# EAGLE design HCPL-7xx (EAGLE 5.11)
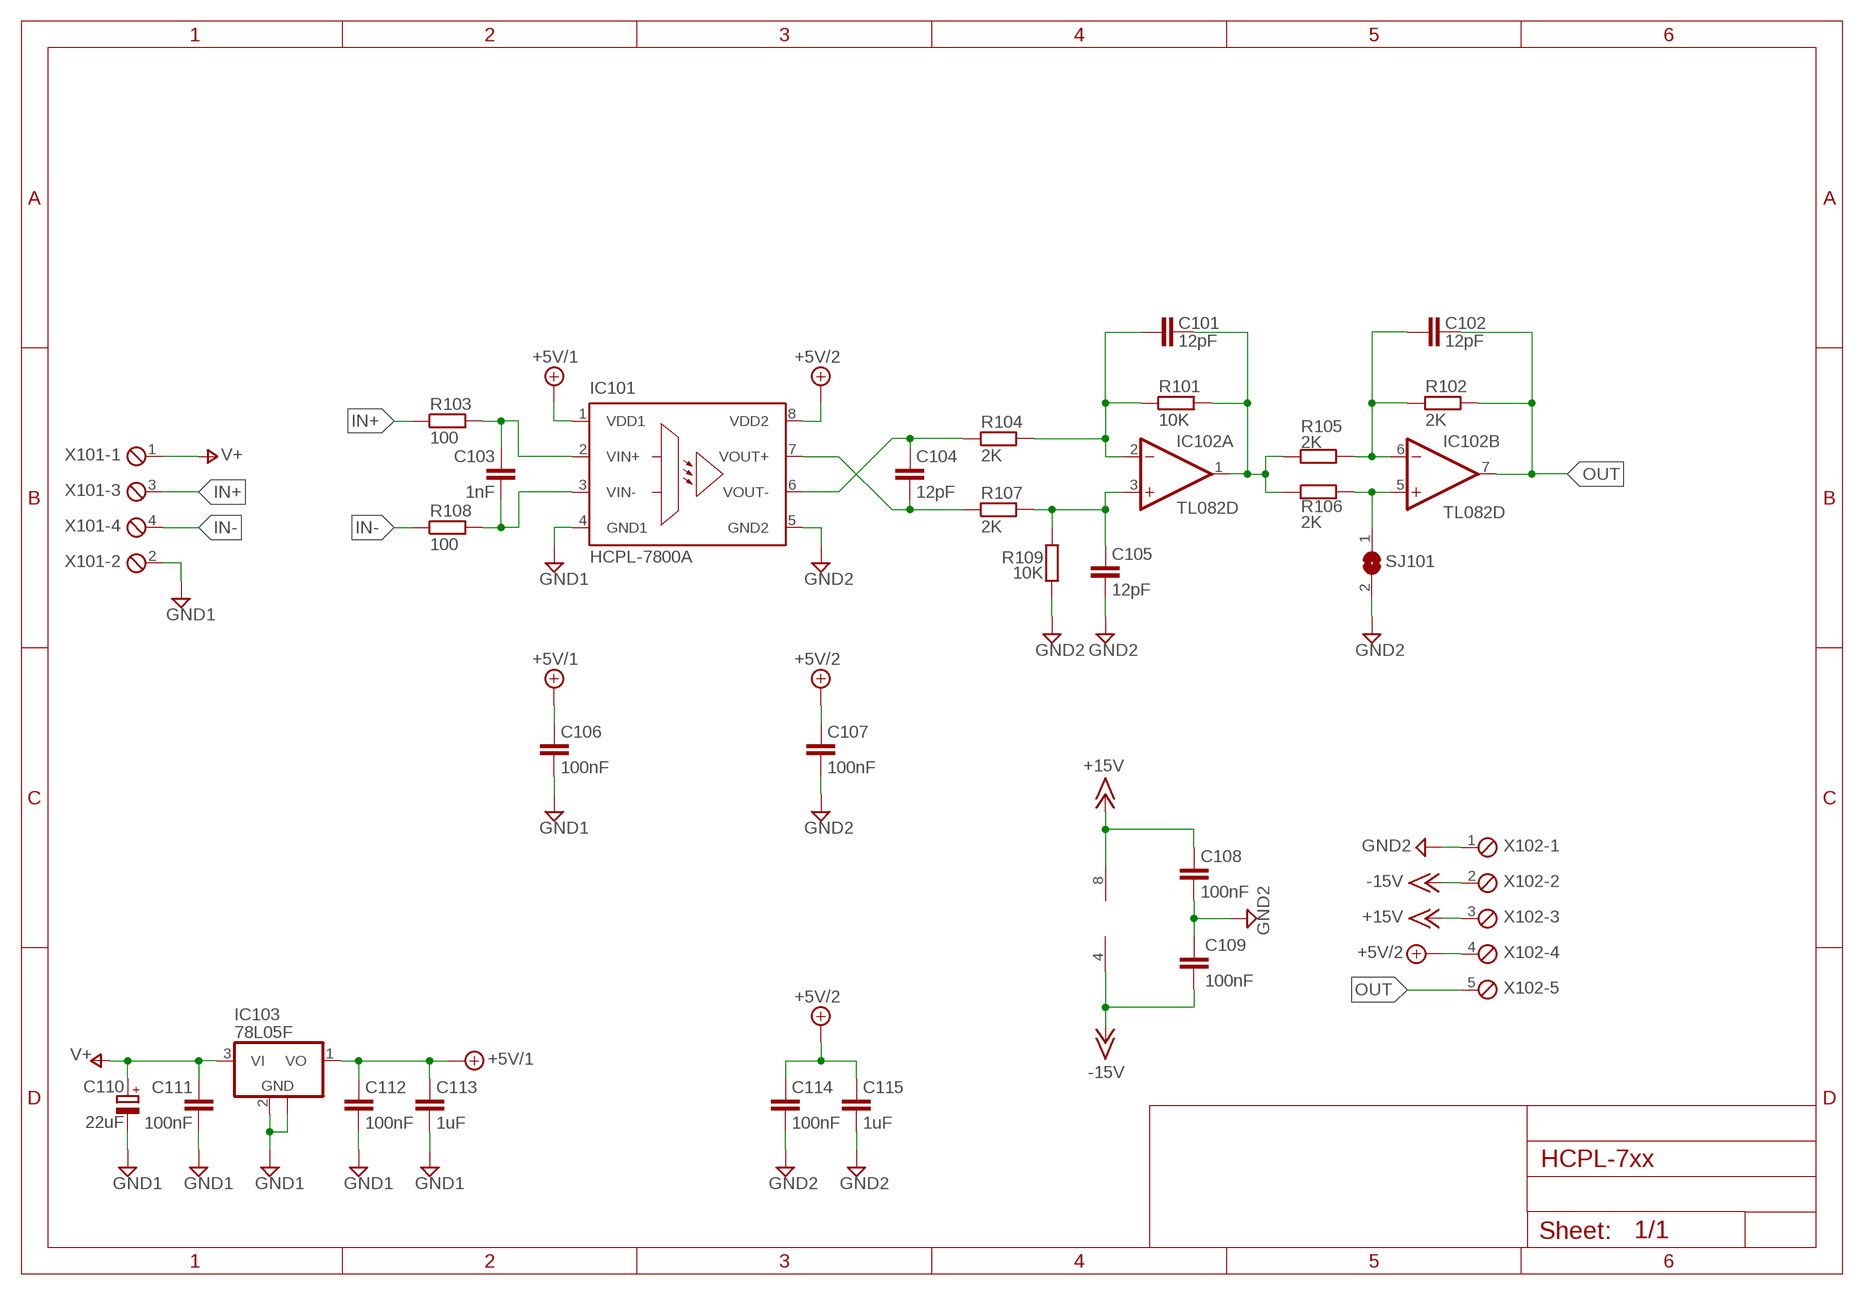
[diagram p0: schematic, sheet 1]

## Parts
C101  12pF  C-EUC0603  [C0603]
C102  12pF  C-EUC0603  [C0603]
C103  1nF  C-EUC0603  [C0603]
C104  12pF  C-EUC0603  [C0603]
C105  12pF  C-EUC0603  [C0603]
C106  100nF  C-EUC0603  [C0603]
C107  100nF  C-EUC0603  [C0603]
C108  100nF  C-EUC0603  [C0603]
C109  100nF  C-EUC0603  [C0603]
C110  22uF  CPOL-EU153CLV-0505  [153CLV-0505]
C111  100nF  C-EUC0603  [C0603]
C112  100nF  C-EUC0603  [C0603]
C113  1uF  C-EUC0603  [C0603]
C114  100nF  C-EUC0603  [C0603]
C115  1uF  C-EUC0603  [C0603]
IC101  HCPL-7800A  [DIP8]
IC102  TL082D  [SO08]
IC103  78L05F  [SOT89]
R101  10K  R-EU_R0603  [R0603]
R102  2K  R-EU_R0603  [R0603]
R103  100  R-EU_R0603  [R0603]
R104  2K  R-EU_R0603  [R0603]
R105  2K  R-EU_R0603  [R0603]
R106  2K  R-EU_R0603  [R0603]
R107  2K  R-EU_R0603  [R0603]
R108  100  R-EU_R0603  [R0603]
R109  10K  R-EU_R0603  [R0603]
SJ101  SJ  [SJ]
X101  MPT4  [4POL254]
X102  MPT5  [5POL254]

## Nets
+5V/1: C106.1 C112.1 C113.1 IC101.1(VDD1) IC103.1(VO)
+5V/2: C107.1 C114.1 C115.1 IC101.8(VDD2) X102.4
+15V: C108.1 IC102.8(P:V+) X102.3
-15V: C109.2 IC102.4(P:V-) X102.2
GND1: C106.2 C110.- C111.2 C112.2 C113.2 IC101.4(GND1) IC103.2(GND) IC103.2@1(GND) X101.2
GND2: C105.1 C107.2 C108.2 C109.1 C114.2 C115.2 IC101.5(GND2) R109.1 SJ101.2 X102.1
IN+: R103.1 X101.3
IN-: R108.1 X101.4
N$1: C101.1 IC102.2(A:-IN) R101.1 R104.2
N$2: C101.2 IC102.1(A:OUT) R101.2 R105.1 R106.1
N$3: C105.2 IC102.3(A:+IN) R107.2 R109.2
N$4: C103.2 IC101.3(VIN-) R108.2
N$5: C103.1 IC101.2(VIN+) R103.2
N$10: C104.2 IC101.7(VOUT+) R107.1
N$11: C104.1 IC101.6(VOUT-) R104.1
N$14: C102.1 IC102.6(B:-IN) R102.1 R105.2
N$16: IC102.5(B:+IN) R106.2 SJ101.1
OUT: C102.2 IC102.7(B:OUT) R102.2 X102.5
V+: C110.+ C111.1 IC103.3(VI) X101.1

## Library data of the parts
C101-C109 C111-C115 = rcl:C-EU: CAPACITOR, European symbol
C110 = rcl:CPOL-EU: POLARIZED CAPACITOR, European symbol
IC101 = avago:HCPL-7800: Isolation Amplifer Source: http://www.avagotech.com/docs/AV02-0410EN; MF: AGILENT TECHNOLOGIES; MPN: HCPL-7800A-000E; OC_FARNELL: 8550026; OC_NEWARK: 88H7847
IC102 = linear:TL082: OP AMP
IC103 = linear:78L*: POSITOIV-VOLTAGE REGULATORS Output up to 100 mA Source: http://focus.ti.com/lit/ds/symlink/ua78l05.pdf
R101-R109 = rcl:R-EU_: RESISTOR, European symbol
SJ101 = jumper:SJ: SMD solder JUMPER
X101 = con-phoenix-254:MPT4: PHOENIX CONNECTOR; OC_FARNELL: unknown; OC_NEWARK: unknown
X102 = con-phoenix-254:MPT5: PHOENIX CONNECTOR; OC_FARNELL: unknown; OC_NEWARK: unknown

## Board
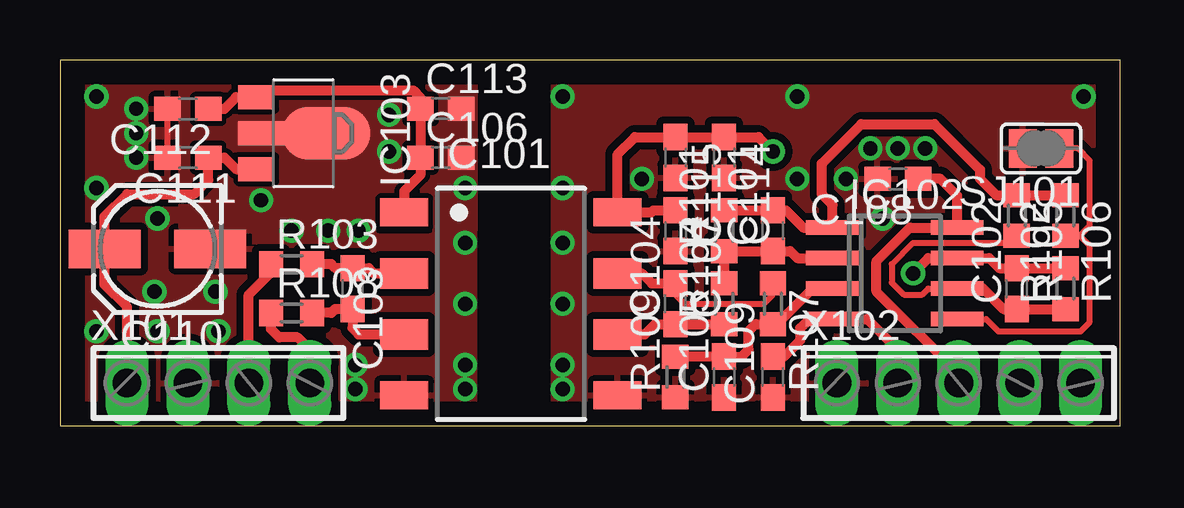
[diagram p1: board, top side]
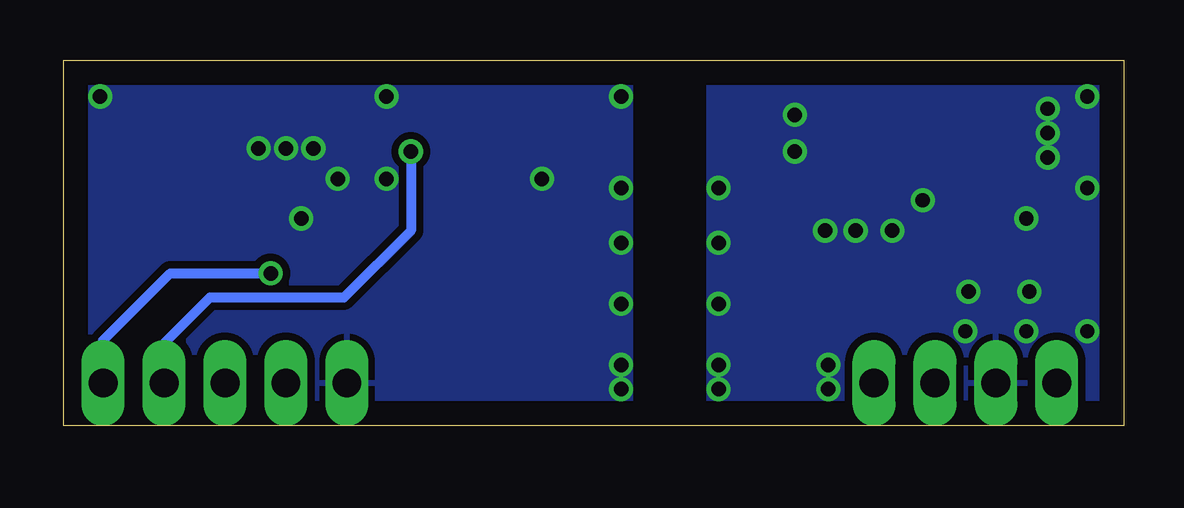
[diagram p2: board, bottom side, seen from below]

Size 44.2 x 15.24 mm. Coordinates in mm from the lower left corner, seen from the top.
Outline: 0,0 44.2,0 44.2,15.24 0,15.24 0,0
Copper layers (1*16): Top 0.035mm / dielectric 1.5mm / Bottom 0.035mm
Design rules "default *": minimum track width 10mil, minimum drill 24mil, track to track 8mil, track to pad 8mil, pad to pad 8mil, via to via 8mil, smd to smd 8mil, copper to edge 40mil, drill to drill 8mil, minimum pad ring 10mil, minimum via ring 8mil, stop-mask expansion 4mil, vias tented up to drill 0mil, thermal gap 10mil

### Footprints (pad centres in the part's own frame; a part is rotated, then mirrored left to right if it is on the bottom)
C0603 = smd 1.1 x 1: 1 -0.85,0; 2 0.85,0
153CLV-0505 = smd 3 x 1.6: + 2.2,0; - -2.2,0
DIP8 = smd 1.16 x 2: 1 -3.81,-4.45; 4 3.81,-4.45; 5 3.81,4.45; 8 -3.81,4.45 | smd 1.27 x 2: 2 -1.27,-4.45; 3 1.27,-4.45; 6 1.27,4.45; 7 -1.27,4.45
SO08 = smd 0.6 x 2.2: 1 -1.905,-2.6; 2 -0.635,-2.6; 3 0.635,-2.6; 4 1.905,-2.6; 5 1.905,2.6; 6 0.635,2.6; 7 -0.635,2.6; 8 -1.905,2.6
SOT89 = smd 1 x 1.5: 1 -1.499,-1.981; 3 1.499,-1.981 | smd 1 x 2: 2 0,-1.727 | smd 2.2 x 3.7: 2@1 0,0.94
R0603 = smd 1 x 1.1: 1 -0.85,0; 2 0.85,0
SJ = smd 1.168 x 1.6: 1 -0.762,0; 2 0.762,0
4POL254 = drill 1.2 long: 1 -3.81,0; 2 -1.27,0; 3 1.27,0; 4 3.81,0
5POL254 = drill 1.2 long: 1 -5.08,0; 2 -2.54,0; 3 0,0; 4 2.54,0; 5 5.08,0

### Placement (x,y rotation side)
C101  29.72,8.13 90 top
C102  39.88,5.71 90 top
C103  12.19,5.71 270 top
C104  25.65,5.08 90 top
C105  27.69,2.03 90 top
C106  15.88,11.18 0 top
C107  25.65,8.13 270 top
C108  34.92,10.29 180 top
C109  29.72,2.03 90 top
C110  4.06,7.37 180 top
C111  5.33,11.18 180 top
C112  5.33,13.21 180 top
C113  15.88,13.21 0 top
C114  27.69,11.18 270 top
C115  25.65,11.18 270 top
IC101  18.8,5.08 270 top
IC102  34.8,6.35 270 top
IC103  10.16,12.19 270 top
R101  27.69,8.13 90 top
R102  41.91,5.71 90 top
R103  9.65,6.73 0 top
R104  27.69,5.08 90 top
R105  39.88,8.76 270 top
R106  41.91,8.76 270 top
R107  29.72,5.08 270 top
R108  9.65,4.7 0 top
R109  25.65,2.03 90 top
SJ101  40.89,11.56 180 top
X101  6.6,1.78 0 top
X102  37.47,1.78 0 top

### Tracks (layer width: path | path; a pad name or v marks a point on that pad's centre or on a via)
+5V/1
  Top 0.254: IC101.1
  Top 0.406: C112.1 6.86,13.21 7.34,13.69 IC103.1 8.46,13.97 14.73,13.97 15.03,13.68 C113.1 C106.1 15.03,10.45 14.35,9.78 IC101.1
+5V/2  (via drill 0.6)
  Top 0.406: C107.1 24.73,8.98 24.64,8.89 IC101.8 23.24,11.3 23.96,12.03 C115.1 C114.1 29.12,12.03 v29.72,11.43
  Bottom 0.406: X102.4 40.01,3.43 38.1,5.33 32.51,5.33 29.72,8.13 v29.72,11.43
+15V
  Top 0.406: X102.3 37.47,2.16 34.04,5.59 34.04,6.86 35.43,8.26 IC102.8 37.4,9.59 36.7,10.29 C108.1
-15V
  Top 0.406: C109.2 30.19,2.88 30.86,3.56 30.86,4.06 31.24,4.45 IC102.4 33.66,4.45 34.92,3.17 X102.2
GND1  (via drill 0.6)
  Top 0.254: C111.2 C112.2
  other vias: 3.17,13.21 16.89,2.54 16.89,1.52 16.89,5.08 16.89,7.62 16.89,9.91 3.17,12.19 1.52,13.72 3.17,11.18 6.6,3.94 3.94,5.59 9.65,8.13 11.18,8.13 12.45,8.13 13.72,11.43 13.72,12.95 12.32,1.52 12.32,2.54 1.52,3.94 4.06,3.94 8.38,9.4 6.48,5.59 4.06,8.64 1.52,9.91
  pour Top (isolate 0.305): 0,0 17.27,0 17.27,15.24 0,15.24
  pour Top (no thermals): 5.08,8.13 5.08,15.24 17.27,15.24 17.27,8.13
  pour Bottom (isolate 0.305): 0,0 17.27,0 17.27,15.24 0,15.24
GND2  (via drill 0.6)
  other vias: 30.73,10.29 34.29,8.64 42.67,13.72 20.95,9.91 20.95,1.52 20.95,7.62 20.95,5.08 36.07,11.56 33.78,11.56 24.26,10.29 30.73,13.72 32.77,10.29 34.92,11.56 20.95,2.54 20.95,13.72
  pour Top (isolate 0.305): 20.57,0 44.45,0 44.45,15.24 20.57,15.24
  pour Bottom (isolate 0.305): 20.57,15.24 44.45,15.24 44.45,0 20.57,0
IN+
  Top 0.254: 8.76,6.35 8.76,6.69
  Top 0.406: X101.3 7.87,5.46 8.76,6.35 | 8.76,6.69 R103.1
IN-
  Top 0.406: X101.4 10.41,3.17 9.91,3.68 9.14,3.68 8.8,4.03 R108.1
N$1
  Top 0.406: R104.2 R101.1 C101.1 30.44,7.28 30.73,6.99 IC102.2
N$2
  Top 0.406: R106.1 R105.1 39.03,9.61 38.35,10.29 38.35,10.67 36.45,12.57 33.4,12.57 31.75,10.92 31.75,9.65 32.2,9.2 IC102.1 30.99,8.26 30.27,8.98 C101.2 R101.2
N$3
  Top 0.406: R109.2 C105.2 28.41,2.88 28.7,3.17 28.7,3.94 29,4.23 R107.2 29.88,4.23 31.37,5.71 IC102.3
N$4
  Top 0.406: R108.2 11.3,4.7 11.47,4.87 C103.2 12.19,4.06 12.45,3.81 IC101.3
N$5
  Top 0.406: R103.2 11.3,6.73 11.47,6.57 C103.1 12.87,6.57 13.08,6.35 IC101.2
N$10
  Top 0.254: R107.1 29.72,5.46 29.34,5.08 26.04,5.08 25.65,5.46 C104.2
  Top 0.406: IC101.7 24.26,6.35 24.68,5.93 C104.2
N$11
  Top 0.406: IC101.6 24.38,3.81 24.8,4.23 C104.1 R104.1
N$14
  Top 0.254: R105.2 39.88,8 39.5,7.62 35.56,7.62 34.67,6.73 34.67,5.97 35.18,5.46 35.94,5.46 36.2,5.71 IC102.6
  Top 0.406: R102.1 C102.1 39.33,4.87 38.48,5.71 IC102.6
N$16
  Top 0.254: IC102.5 38.61,4.45 39.12,3.94 42.55,3.94 42.93,4.32 42.93,7.49 42.51,7.91 | 42.51,7.91 R106.2 | 42.51,7.91 42.93,8.33 42.93,11.05 42.42,11.56 SJ101.1
OUT  (via drill 0.6)
  Top 0.406: R102.2 C102.2 39.16,6.57 38.73,6.99 IC102.7 36.2,6.99 v35.56,6.35
  Bottom 0.406: v35.56,6.35 39.75,6.35 42.55,3.56 X102.5
V+
  Top 0.406: IC103.3 7.34,10.69 6.86,11.18 C111.1 6.18,10.25 5.59,9.65 2.79,9.65 1.86,8.72 C110.+ 1.86,5.88 2.79,4.95 X101.1